# EasyEDA Pro project 自制焊接风扇.epro

# Schematic Schematic1
Board Name: Board1
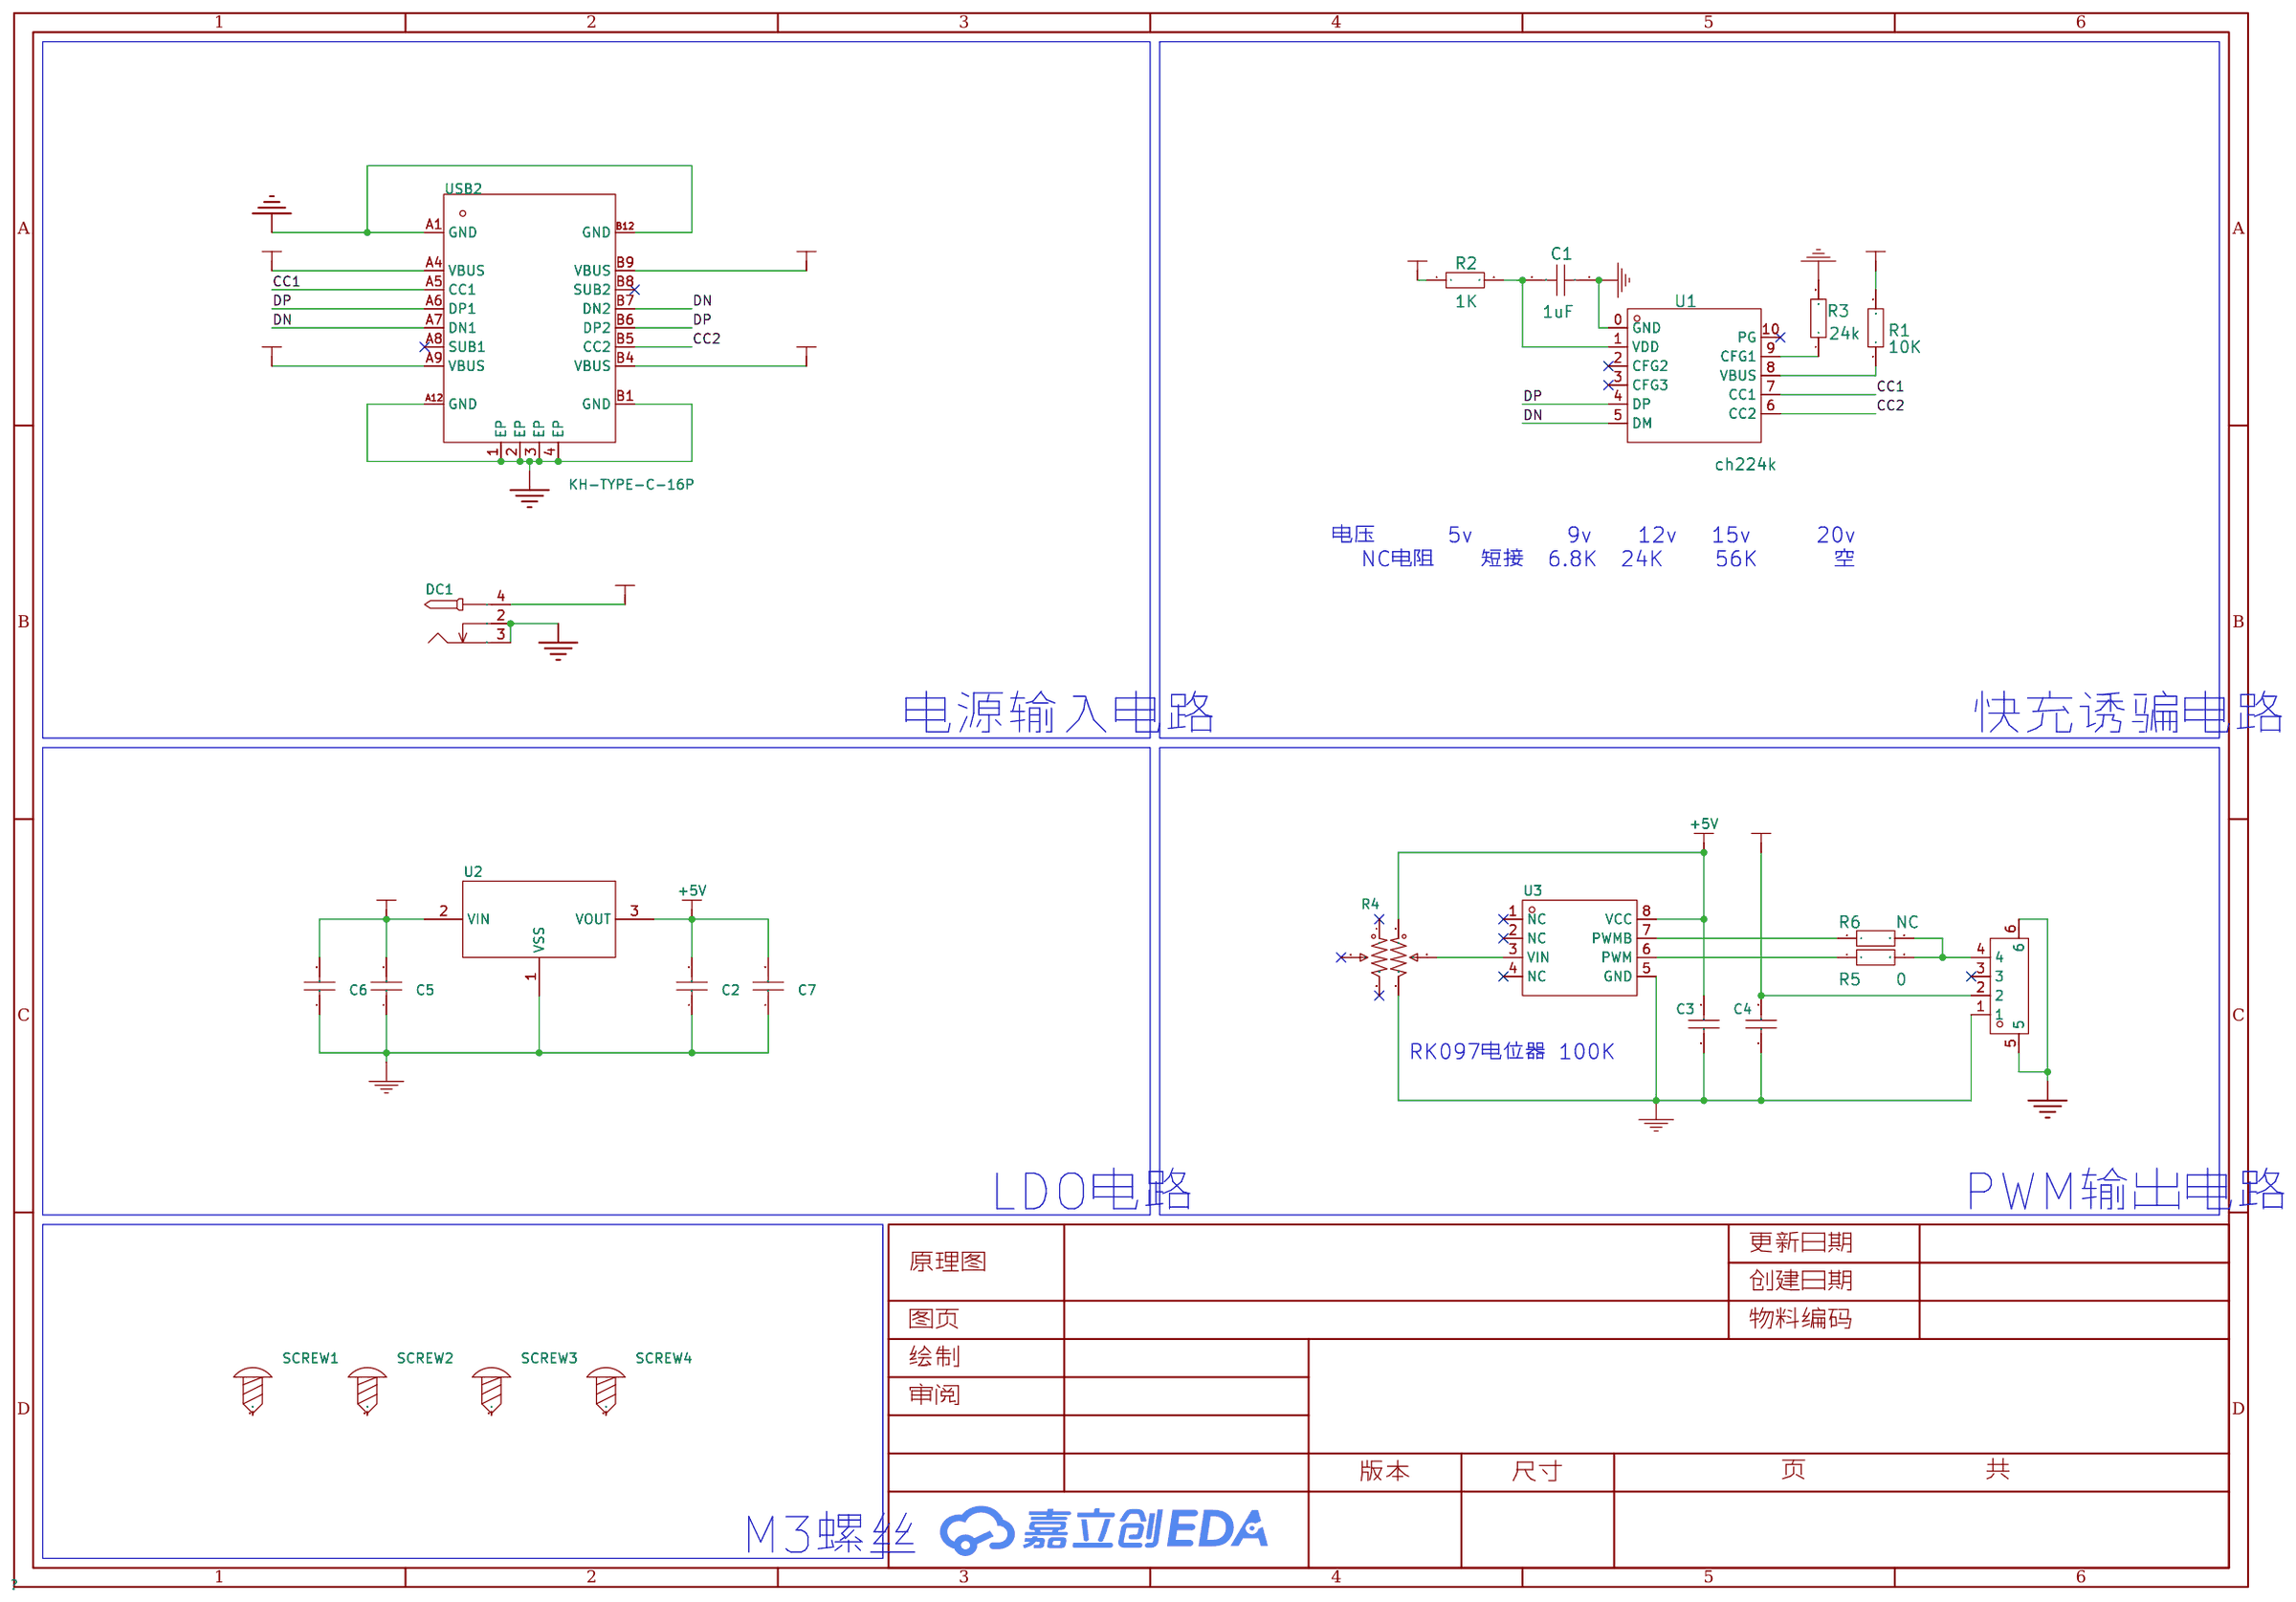
[diagram p0: schematic sheet]

## Parts
C1  1uF  [C0805]
C2  10uF  [C0805]
C3  10uF  [C0805]
C4  10uF  [C0805]
C5  10uF  [C0805]
C6  10uF  [C0805]
C7  10uF  [C0805]
DC1  -  [DC-2.0]
P2  CONN-SMD_XH2.54-4PSMD  [CONN-SMD_XH2.54-4PSMD]
R1  10K  [R0805]
R2  1K  [R0805]
R3  24k  [R0805]
R4  100kΩ  [RES-ADJ-TH_RK09712200MY]
R5  0  [R0805]
R6  NC  [R0805]
SCREW1  -  [M3螺丝]
SCREW2  -  [M3螺丝]
SCREW3  -  [M3螺丝]
SCREW4  -  [M3螺丝]
U1  ch224k  [CH224K]
U2  ME6203A50PG  [SOT-89_L4.5-W2.5-P1.50-LS4.2-BR]
U3  GP9101-F20K-L2H1-SW  [SOP-8_L5.0-W3.9-P1.27-LS6.0-BL]
USB2  KH-TYPE-C-16P  [USB-C-SMD_KH-TYPE-C-16P]

## Library data of the parts
C1 = CL10B104KC8NNNC: Supplier: LCSC; Manufacturer: SAMSUNG; Supplier Part: C15725; JLCPCB Part Class: Extend
C2-C7 = GRM188R6YA106MA73D: 容值:10uF;精度:±20%;额定电压:35V;材质(温度系数):-;; LCSC Part Name: 10uF ±20% 35V; Supplier Part: C194427; Manufacturer: muRata(村田); Supplier Footprint: 0603; JLCPCB Part Class: Extended Part; Datasheet: https://atta.szlcsc.com/upload/public/pdf/source/20210128/C194427_FCA3640823207DDB58700A82F1A19B5F.pdf; Supplier: LCSC; Tolerance: ±20%; Voltage Rated: 35V
DC1 = DC-005_2.0: Supplier Footprint: 插件
P2 = CONN-SMD_XH2.54-4PSMD: Supplier Part: C9900018341; Supplier Footprint: CONN-SMD-4P; JLCPCB Part Class: 扩展库; Datasheet: https://atta.szlcsc.comnull; Supplier: LCSC
R1-R3 R5 R6 = 0603WAJ0000T5E: Supplier: LCSC; Manufacturer: UniOhm; Supplier Part: C15402; JLCPCB Part Class: ExtendedPart
R4 = RK09712200MY: 阻值:10kΩ;精度:±20%;; LCSC Part Name: 10kΩ ±20% 三件套; Supplier Part: C231763; Manufacturer: ALPSALPINE(阿尔卑斯阿尔派); Supplier Footprint: 插件; JLCPCB Part Class: 扩展库; Datasheet: https://atta.szlcsc.com/upload/public/pdf/source/20180613/C231763_9E66DA42F71BD8737D63C600D8EF512E.pdf; Supplier: LCSC; Tolerance: ±20%
SCREW1-SCREW4 = M3螺丝: Supplier Footprint: 插件
U1 = CH224DS1: Manufacturer: WCH; link: http://www.wch.cn/downloads/CH224DS1_PDF.html
U2 = ME6203A50PG: 输出类型:固定;输出极性:正;输出通道数:1;最大输入电压:30V;输出电压:5V;压差:-;输出电流:100mA;电源纹波抑制比(PSRR):40dB@(1kHz);; LCSC Part Name: 正 Vin=30V Vout=5V 100mA 40dB@(1kHz); Supplier Part: C94056; Manufacturer: MICRONE(南京微盟); Supplier Footprint: SOT-89; JLCPCB Part Class: 扩展库; Datasheet: https://atta.szlcsc.com/upload/public/pdf/source/20170116/1484561288466.pdf; Supplier: LCSC; Output Type: 固定; Output Polarity: 正; Number of Outputs: 1; Maximum Input Voltage: 30V; Output Voltage: 5V; Output Current: 100mA; Power Supply Rejection Ratio (PSRR): 40dB@(1kHz)
U3 = GP9101-F20K-L2H1-SW: GP9101 0-VCC转PWM 20KHz L2H1; LCSC Part Name: 模拟信号转PWM信号; Supplier Part: C2837710; Manufacturer: Guestgood(客益); Supplier Footprint: SOP8; JLCPCB Part Class: 扩展库; Datasheet: https://atta.szlcsc.com/upload/public/pdf/source/20210611/C2837710_B55E2012AD9BA99B0BFF632E52DE3359.pdf; Supplier: LCSC
USB2 = KH-TYPE-C-16P: 连接器类型:Type-C;标准:-;公母:母;端口数量:1;触点数量:16P;安装方式:卧贴;额定电流 - 电源:3A;工作温度范围:-40℃~+85℃;; LCSC Part Name: Type-C 母 卧贴; Supplier Part: C709357; Manufacturer: kinghelm(金航标); Supplier Footprint: SMD; Datasheet: https://atta.szlcsc.com/upload/public/pdf/source/20200911/C709357_AA8DCEB38BB20E3035A7ED7AE7667837.pdf; Supplier: LCSC; Connector Type: Type-C; Gender: 母; Number of Ports: 1; Number of Contacts: 16P; Mounting Style: 卧贴; Current Rating - Power (Max): 3A; Operating Temperature Range: -40℃~+85℃

## Nets
+5V: C2.2 C3.2 C7.2 R4.1 U2.3(VOUT) U3.8(VCC)
+12V: C4.2 C5.2 C6.2 P2.2 U2.2(VIN)
GND: C1.1 C2.1 C3.1 C4.1 C5.1 C6.1 C7.1 DC1.2 DC1.3 P2.1 P2.5 P2.6 R3.2 R4.3 U1.0(GND) U2.1(VSS) U3.5(GND) USB2.1(EP) USB2.2(EP) USB2.3(EP) USB2.4(EP) USB2.A1(GND) USB2.A12(GND) USB2.B1(GND) USB2.B12(GND)
VBUS: DC1.4 R1.2 R2.1 USB2.A4(VBUS) USB2.A9(VBUS) USB2.B4(VBUS) USB2.B9(VBUS)
CC1: U1.7(CC1) USB2.A5(CC1)
CC2: U1.6(CC2) USB2.B5(CC2)
DN: U1.5(DM) USB2.A7(DN1) USB2.B7(DN2)
DP: U1.4(DP) USB2.A6(DP1) USB2.B6(DP2)
$1N913: R3.1 U1.9(CFG1)
$1N917: R1.1 U1.8(VBUS)
$1N933: C1.2 R2.2 U1.1(VDD)
$1N1377: R4.2 U3.3(VIN)
$1N2436: R5.1 U3.6(PWM)
$1N2439: P2.4 R5.2 R6.2
$1N2471: R6.1 U3.7(PWMB)

Not connected (* = marked no-connect by the designer): P2 3*; R4 4* 5* 6*; SCREW1 1; SCREW2 1; SCREW3 1; SCREW4 1; U1 2(CFG2)* 3(CFG3)* 10(PG)*; U3 1(NC)* 2(NC)* 4(NC)*; USB2 A8(SUB1)* B8(SUB2)*

## Notes on the sheet
- 电压     	5v    	9v 	 12v   15v	 20v
  NC电阻    短接	 6.8K  24K 	56K  	空
- 电源输入电路
- 快充诱骗电路
- RK097电位器 100K
- LDO电路
- PWM输出电路
- M3螺丝

# Board PCB1
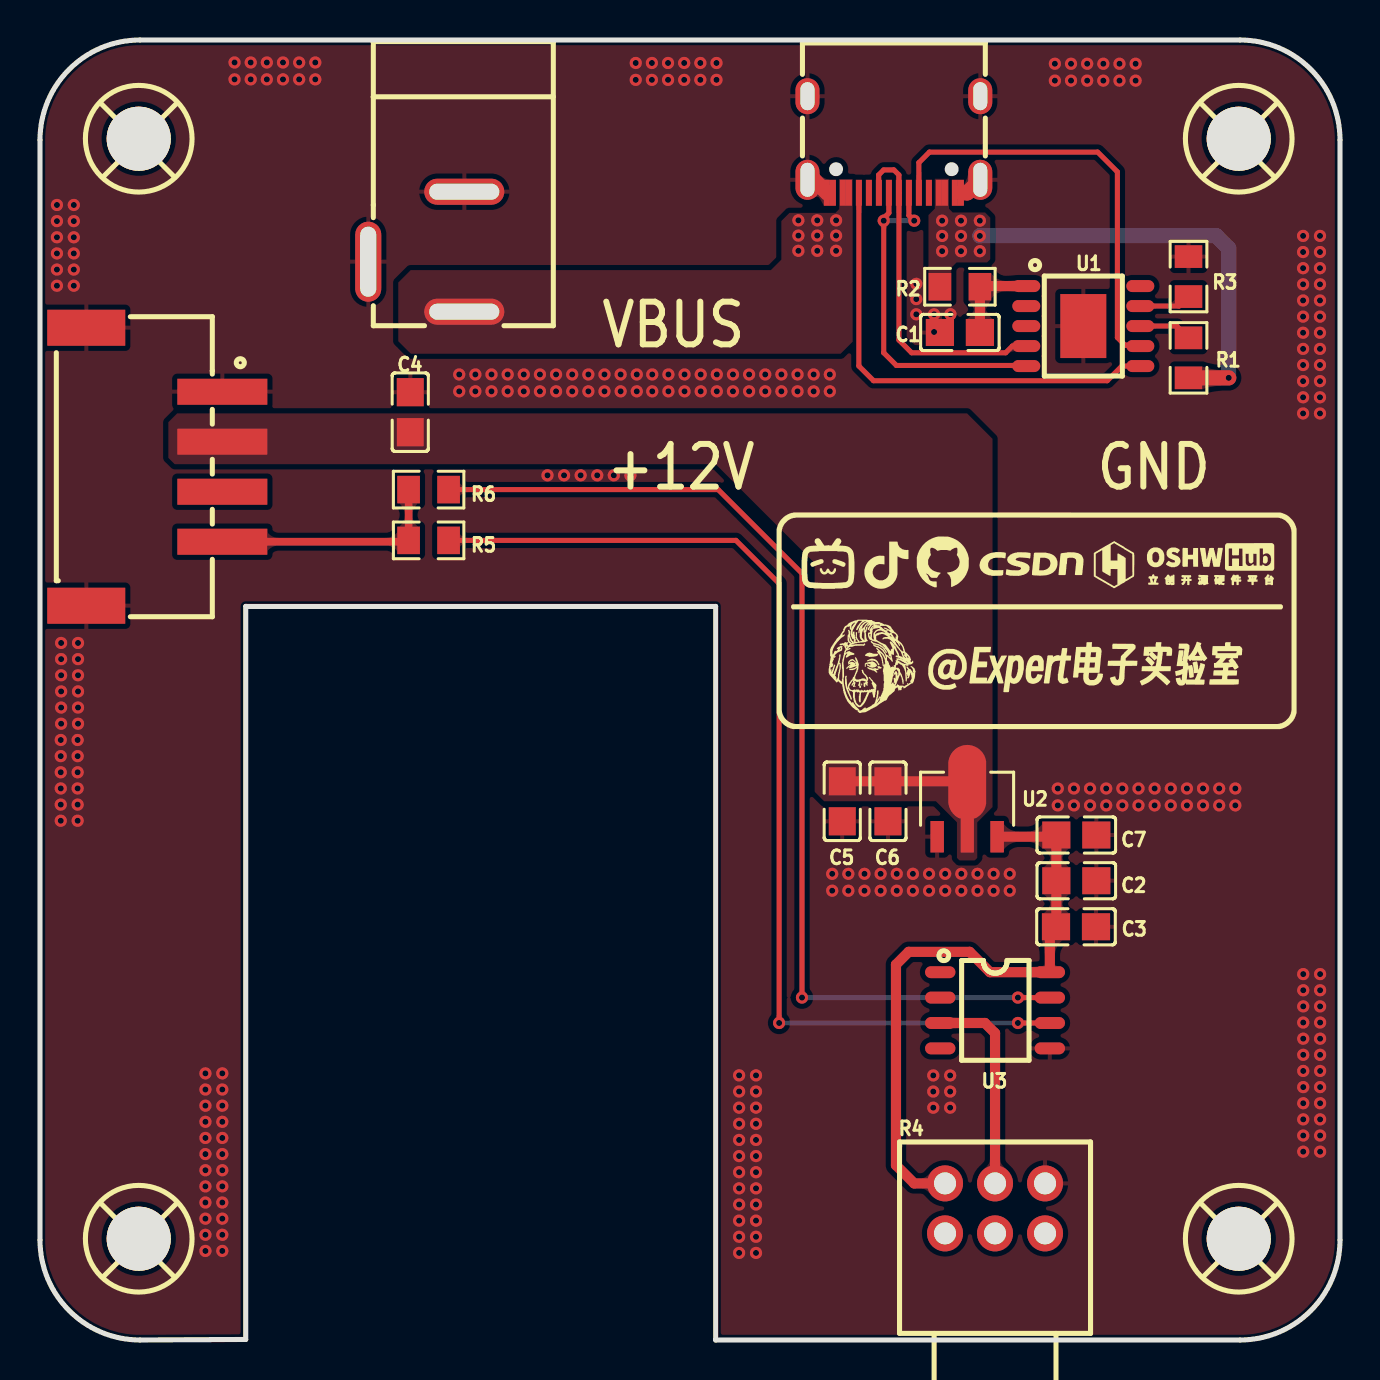
[diagram p1: board, top side]
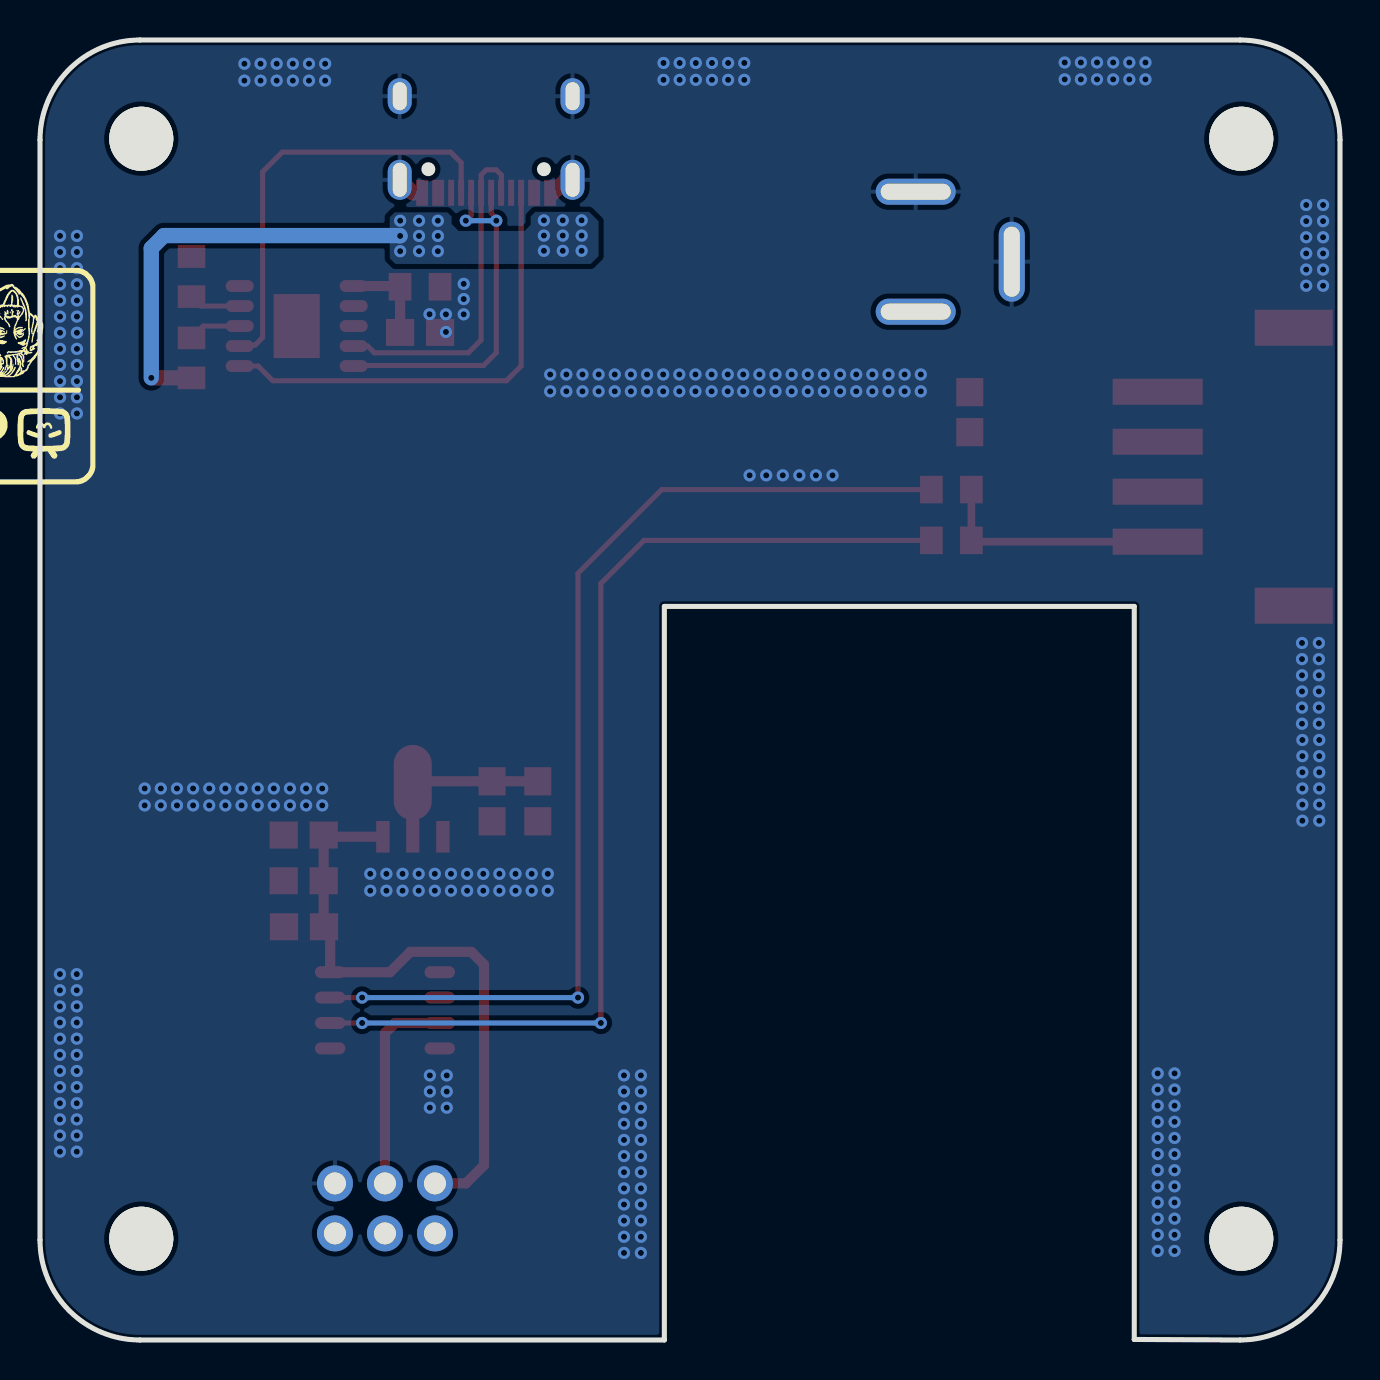
[diagram p2: board, bottom side, seen from below]

Outline 65 x 65 mm; copper layers: Top Layer, Bottom Layer. Coordinates in mm from the lower left corner of the outline.
Outline path: 0,60 arc(1.46,63.54) 5,65 60,65 arc(63.54,63.54) 65,60 65,5 arc(63.54,1.46) 60,0 33.78,0 33.78,36.68 10.29,36.68 10.29,0.03 5,0 arc(1.46,1.46) 0,5 0,60
Stack: Top Layer 0.035mm / Dielectric1 1.51mm FR4 er 4.5 / Bottom Layer 0.035mm

## Design rules (mm)
template: 自定义配置
spacing copperThickness1oz (default): track to track 0.102, other pairs 0.102 to 0.3
spacing copperThickness2oz: track to track 0.203, other pairs 0.152 to 0.3
track width copperThickness1oz (default): min 0.127, default 0.254, max 2.54
track width copperThickness2oz: min 0.203, default 0.254, max 2.54
differential pair differentialPair (default): width min 0.127, default 0.254, max 2.54; gap min 0.152, default 0.152
via viaSize (default): diameter min 0.5, default 0.61, max 10; hole min 0.3, default 0.305, max 6.299

## Placement (name value [footprint] x y rotation side)
C1  1uF  [C0805]  46 50.38 0 top
C2  10uF  [C0805]  51.82 22.96 180 top
C3  10uF  [C0805]  51.8 20.66 180 top
C4  10uF  [C0805]  18.51 46.39 270 top
C5  10uF  [C0805]  42.4 26.94 90 top
C6  10uF  [C0805]  40.11 26.94 90 top
C7  10uF  [C0805]  51.82 25.25 180 top
DC1  -  [DC-2.0]  21.48 54.54 90 top
P2  -  [CONN-SMD_XH2.54-4PSMD]  5.72 43.66 270 top
R1  10K  [R0805]  57.43 49.11 270 top
R2  1K  [R0805]  46 52.66 0 top
R3  24k  [R0805]  57.43 53.17 90 top
R4  100kΩ  [RES-ADJ-TH_RK09712200MY]  47.75 6.58 0 top
R5  0  [R0805]  19.43 39.98 180 top
R6  NC  [R0805]  19.43 42.52 180 top
SCREW1  -  [M3螺丝]  5 60 0 top
SCREW2  -  [M3螺丝]  60 60 0 top
SCREW3  -  [M3螺丝]  5 5 0 top
SCREW4  -  [M3螺丝]  60 5 0 top
U1  ch224k  [CH224K]  52.17 50.7 0 top
U2  ME6203A50PG  [SOT-89_L4.5-W2.5-P1.50-LS4.2-BR]  46.35 26.52 270 top
U3  GP9101-F20K-L2H1-SW  [SOP-8_L5.0-W3.9-P1.27-LS6.0-BL]  47.75 16.49 270 top
USB2  KH-TYPE-C-16P  [USB-C-SMD_KH-TYPE-C-16P]  42.69 59.78 180 top

## Footprints (pads in the part's own frame, mm; a bottom-side part is the same pattern mirrored in y, then rotated)
C0805
  rect 1.41x1.35 smd: 1(-1,0) 2(1,0)
CH224K
  rect 2.3x3.2 smd: 0(0,0)
  oval 1.4x0.6 smd: 1(-2.85,2) 2(-2.85,1) 3(-2.85,0) 4(-2.85,-1) 5(-2.85,-2) 6(2.85,-2) 7(2.85,-1) 8(2.85,0) 9(2.85,1) 10(2.85,2)
CONN-SMD_XH2.54-4PSMD
  rect 1.3x4.501 smd: 1(-3.749,3.401) 2(-1.25,3.401) 3(1.25,3.401) 4(3.749,3.401)
  rect 1.801x3.899 smd: 5(-6.949,-3.401) 6(6.949,-3.401)
DC-2.0
  oval 4x1.3 hole 3.5x0.8: 2(-0.627,5.067)
  oval 1.3x4 hole 0.8x3.5: 3(2.873,0.267) 4(-3.127,0.267)
M3螺丝
  round 3.2 hole 3.2: 1(-0.064,0.064)
R0805
  rect 1.133x1.377 smd: 1(-1,0) 2(1,0)
RES-ADJ-TH_RK09712200MY
  round 1.8 hole 1.1: 1(-2.5,1.25) 2(0,1.25) 3(2.5,1.25) 4(-2.5,-1.25) 5(0,-1.25) 6(2.5,-1.25)
SOP-8_L5.0-W3.9-P1.27-LS6.0-BL
  oval 0.6x1.52 smd: 1(-1.905,-2.74) 2(-0.635,-2.74) 3(0.635,-2.74) 4(1.905,-2.74) 5(1.905,2.74) 6(0.635,2.74) 7(-0.635,2.74) 8(-1.905,2.74)
SOT-89_L4.5-W2.5-P1.50-LS4.2-BR
  rect 1.575x0.673 smd: 1(1.357,-1.498) 3(1.357,1.501)
  custom 5.378x1.9 smd: 2(-1.357,0.007)
USB-C-SMD_KH-TYPE-C-16P
  oval 1.2x2 hole 0.7x1.7: 1(-4.32,1.765) 2(4.32,1.765)
  oval 1.2x1.8 hole 0.7x1.4: 3(-4.32,-2.415) 4(4.32,-2.415)
  rect 0.3x1.3 smd: A1(-3.35,2.415) A4(-2.55,2.415) A5(-1.25,2.415) A6(-0.25,2.415) A7(0.25,2.415) A8(1.25,2.415) A9(2.55,2.415) A12(3.35,2.415) B1(3.05,2.415) B4(2.25,2.415) B5(1.75,2.415) B6(0.75,2.415) B7(-0.75,2.415) B8(-1.75,2.415) B9(-2.25,2.415) B12(-3.05,2.415)

## Nets
As in the schematic.

Pads without a net: P2 3; R4 4 5 6; SCREW1 1; SCREW2 1; SCREW3 1; SCREW4 1; U1 2 3 10; U3 1 2 4; USB2 A8 B8

## Via types
v1: diameter 0.61, hole 0.305, Top Layer to Bottom Layer, 307 vias

## Routing (per net, layer and track width the routed paths; a pad name or vN(x,y) marks a point on that pad's centre or on a via; arc(x,y) is an arc through that point)
+5V: length 31.2
  Top Layer w0.508: U2.3 50.73,25.16 C7.2 C2.2 50.82,20.68 C3.2 50.49,20.35 U3.8 47.5,18.39 46.48,19.41 43.43,19.41 42.8,18.77 42.8,8.74 43.71,7.83 R4.1
+12V: length 6.3
  Top Layer w0.508: C6.2 C5.2 46.3,27.94 U2.2
GND: length 2.5
  Top Layer w0.762: USB2.A12 38.69,58.01 USB2.2 ; USB2.1 46.36,57.36 USB2.A1
  vias: v1(0.85,56.75) v1(0.85,55.94) v1(0.85,55.14) v1(0.85,54.33) v1(0.85,53.52) v1(0.85,52.71) v1(1.04,30) v1(1.04,29.19) v1(1.04,28.39) v1(1.04,27.58) v1(1.04,26.77) v1(1.04,25.96) v1(1.06,34.85) v1(1.06,34.04) v1(1.06,33.24) v1(1.06,32.43) v1(1.06,31.62) v1(1.06,30.81) v1(1.69,56.75) v1(1.69,55.94) v1(1.69,55.14) v1(1.69,54.33) v1(1.69,53.52) v1(1.69,52.71) v1(1.9,34.85) v1(1.9,34.04) v1(1.9,33.24) v1(1.9,32.43) v1(1.9,31.62) v1(1.9,30.81) v1(1.88,30) v1(1.88,29.19) v1(1.88,28.39) v1(1.88,27.58) v1(1.88,26.77) v1(1.88,25.96) v1(8.27,13.33) v1(8.27,12.52) v1(8.27,11.72) v1(8.27,10.91) v1(8.27,10.1) v1(8.27,9.3) v1(8.27,8.49) v1(8.27,7.68) v1(8.27,6.87) v1(8.27,6.07) v1(8.27,5.26) v1(8.27,4.45) v1(9.12,13.33) v1(9.12,12.52) v1(9.12,11.72) v1(9.12,10.91) v1(9.12,10.1) v1(9.12,9.3) v1(9.12,8.49) v1(9.12,7.68) v1(9.12,6.87) v1(9.12,6.07) v1(9.12,5.26) v1(9.12,4.45) v1(9.73,63.88) v1(9.73,63.03) v1(10.53,63.88) v1(10.53,63.03) v1(11.34,63.88) v1(11.34,63.03) v1(12.15,63.88) v1(12.15,63.03) v1(12.96,63.88) v1(12.96,63.03) v1(13.76,63.88) v1(13.76,63.03) v1(20.96,48.28) v1(20.96,47.43) v1(21.77,48.28) v1(21.77,47.43) v1(22.58,48.28) v1(22.58,47.43) v1(23.38,48.28) v1(23.38,47.43) v1(24.19,48.28) v1(24.19,47.43) v1(25,48.28) v1(25,47.43) v1(25.37,43.23) v1(25.8,48.28) v1(25.8,47.43) v1(26.2,43.23) v1(26.61,48.28) v1(26.61,47.43) v1(27.03,43.23) v1(27.42,48.28) v1(27.42,47.43) v1(27.86,43.23) v1(28.22,48.28) v1(28.22,47.43) v1(28.69,43.23) v1(29.03,48.28) v1(29.03,47.43) v1(29.52,43.23) v1(29.79,63.85) v1(29.79,63.01) v1(29.84,48.28) v1(29.84,47.43) v1(30.59,63.85) v1(30.59,63.01) v1(30.61,48.28) v1(30.61,47.43) v1(31.4,63.85) v1(31.4,63.01) v1(31.42,48.28) v1(31.42,47.43) v1(32.21,63.85) v1(32.21,63.01) v1(32.23,48.28) v1(32.23,47.43) v1(33.02,63.85) v1(33.02,63.01) v1(33.03,48.28) v1(33.03,47.43) v1(33.82,63.85) v1(33.82,63.01) v1(33.84,48.28) v1(33.84,47.43) v1(34.65,48.28) v1(34.65,47.43) v1(34.96,13.23) v1(34.96,12.42) v1(34.96,11.62) v1(34.96,10.81) v1(34.96,10) v1(34.96,9.2) v1(34.96,8.39) v1(34.96,7.58) v1(34.96,6.78) v1(34.96,5.97) v1(34.96,5.16) v1(34.96,4.35) v1(35.46,48.28) v1(35.46,47.43) v1(35.8,13.23) v1(35.8,12.42) v1(35.8,11.62) v1(35.8,10.81) v1(35.8,10) v1(35.8,9.2) v1(35.8,8.39) v1(35.8,7.58) v1(35.8,6.78) v1(35.8,5.97) v1(35.8,5.16) v1(35.8,4.35) v1(36.26,48.28) v1(36.26,47.43) v1(37.07,48.28) v1(37.07,47.43) v1(37.88,48.28) v1(37.88,47.43) v1(38.68,48.28) v1(38.68,47.43) v1(39.49,48.28) v1(39.49,47.43) v1(39.61,23.31) v1(39.61,22.46) v1(40.42,23.31) v1(40.42,22.46) v1(41.22,23.31) v1(41.22,22.46) v1(42.03,23.31) v1(42.03,22.46) v1(42.84,23.31) v1(42.84,22.46) v1(43.65,23.31) v1(43.65,22.46) v1(43.81,52.81) v1(43.81,52.05) v1(43.81,51.28) v1(44.45,23.31) v1(44.45,22.46) v1(44.7,51.28) v1(44.7,50.4) v1(44.66,13.23) v1(44.66,12.42) v1(44.66,11.61) v1(45.26,23.31) v1(45.26,22.46) v1(45.52,51.29) v1(45.51,13.23) v1(45.51,12.42) v1(45.51,11.61) v1(46.07,23.31) v1(46.07,22.46) v1(46.87,23.31) v1(46.87,22.46) v1(47.68,23.31) v1(47.68,22.46) v1(48.49,23.31) v1(48.49,22.46) v1(50.74,63.81) v1(50.74,62.97) v1(50.89,27.58) v1(50.89,26.73) v1(51.55,63.81) v1(51.55,62.97) v1(51.7,27.58) v1(51.7,26.73) v1(52.36,63.81) v1(52.36,62.97) v1(52.5,27.58) v1(52.5,26.73) v1(53.17,63.81) v1(53.17,62.97) v1(53.31,27.58) v1(53.31,26.73) v1(53.97,63.81) v1(53.97,62.97) v1(54.12,27.58) v1(54.12,26.73) v1(54.78,63.81) v1(54.78,62.97) v1(54.92,27.58) v1(54.92,26.73) v1(55.73,27.58) v1(55.73,26.73) v1(56.54,27.58) v1(56.54,26.73) v1(57.35,27.58) v1(57.35,26.73) v1(58.15,27.58) v1(58.15,26.73) v1(58.96,27.58) v1(58.96,26.73) v1(59.77,27.58) v1(59.77,26.73) v1(63.15,55.21) v1(63.15,54.4) v1(63.15,53.59) v1(63.15,52.78) v1(63.15,51.98) v1(63.15,51.17) v1(63.15,50.36) v1(63.15,49.56) v1(63.15,48.75) v1(63.15,47.94) v1(63.15,47.14) v1(63.15,46.33) v1(63.16,18.29) v1(63.16,17.49) v1(63.16,16.68) v1(63.16,15.87) v1(63.16,15.07) v1(63.16,14.26) v1(63.16,13.45) v1(63.16,12.64) v1(63.16,11.84) v1(63.16,11.03) v1(63.16,10.22) v1(63.16,9.42) v1(64,55.21) v1(64,54.4) v1(64,53.59) v1(64,52.78) v1(64,51.98) v1(64,51.17) v1(64,50.36) v1(64,49.56) v1(64,48.75) v1(64,47.94) v1(64,47.14) v1(64,46.33) v1(64.01,18.29) v1(64.01,17.49) v1(64.01,16.68) v1(64.01,15.87) v1(64.01,15.07) v1(64.01,14.26) v1(64.01,13.45) v1(64.01,12.64) v1(64.01,11.84) v1(64.01,11.03) v1(64.01,10.22) v1(64.01,9.42)
VBUS: length 21.2
  Top Layer w0.762: R1.2 v1(59.44,48.11)
  Bottom Layer w0.762: v1(59.44,48.11) 59.44,54.59 58.8,55.22 47.01,55.22 v1(46.99,55.2)
  vias: v1(37.92,55.98) v1(37.92,55.22) v1(37.92,54.46) v1(38.86,55.98) v1(38.86,55.22) v1(38.86,54.46) v1(39.81,55.98) v1(39.81,55.22) v1(39.81,54.46) v1(45.11,55.97) v1(45.11,55.2) v1(45.11,54.44) v1(46.05,55.97) v1(46.05,55.2) v1(46.05,54.44) v1(46.99,55.97) v1(46.99,54.44)
CC1: length 21.7
  Top Layer w0.254: USB2.A5 43.94,58.87 44.47,59.39 52.88,59.39 53.87,58.41 53.87,50.12 54.25,49.74 54.97,49.74 U1.7
CC2: length 23.3
  Top Layer w0.254: USB2.B5 40.94,48.7 41.68,47.96 53.36,47.96 54.09,48.7 U1.6
DN: length 18.5
  Top Layer w0.254: USB2.A7 42.44,56.35 42.19,56.09 v1(42.19,55.97) 42.19,49.36 42.82,48.73 49.29,48.73 U1.5 ; USB2.B7 43.44,56.23 v1(43.71,55.97)
  Bottom Layer w0.254: v1(43.71,55.97) v1(42.19,55.97)
DP: length 17.1
  Top Layer w0.254: USB2.B6 41.93,57.37 41.93,58.25 42.19,58.5 42.69,58.5 42.94,58.25 USB2.A6 42.95,57.36 42.95,50 43.58,49.36 48.28,49.36 48.62,49.7 U1.4
$1N913: length 2.6
  Top Layer w0.254: U1.9 56.95,51.7 R3.1
$1N917: length 2.7
  Top Layer w0.254: U1.8 56.84,50.7 R1.1
$1N933: length 4.6
  Top Layer w0.508: U1.1 47.03,52.7 R2.2 C1.2
$1N1377: length 10.5
  Top Layer w0.508: R4.2 47.75,15.34 47.24,15.85 U3.3
$1N2436: length 52.9
  Top Layer w0.254: v1(36.96,15.85) 36.96,37.82 34.8,39.98 R5.1 ; v1(48.9,15.85) U3.6
  Bottom Layer w0.254: v1(36.96,15.85) v1(48.9,15.85)
$1N2439: length 11.9
  Top Layer w0.381: R5.2 R6.2 ; P2.4 18.37,39.92 18.43,39.98
$1N2471: length 53
  Top Layer w0.254: v1(48.9,17.12) 50.49,17.12 ; v1(38.1,17.12) 38.1,38.33 33.91,42.52 R6.1
  Bottom Layer w0.254: v1(38.1,17.12) v1(48.9,17.12)

## Copper pours and planes (outline as drawn; the poured copper is in the pictures)
+12V on Top Layer: 6.42,46.33 47.62,46.33 47.62,23.98 6.42,23.98
GND on Top Layer: -7.67,69.03 66,69.03 66,-4.19 -7.67,-4.19
GND on Bottom Layer: -11.78,71.58 67.44,71.58 67.44,-5.86 -11.78,-5.86
VBUS on Top Layer: 44.42,58.06 47.51,58.06 47.51,51.95 44.42,51.95
VBUS on Top Layer: 17.91,58.05 40.63,58.05 40.63,49.31 17.91,49.31
VBUS on Bottom Layer: 37.07,56.41 47.51,56.41 47.51,53.8 37.07,53.8

Small or netless copper shapes (teardrops, artwork), in the pictures only: 53 on Top Layer, 6 on Bottom Layer

## Text on the board
Top Silkscreen Layer: VBUS | +12V | GND
